# Altium schematic sheet HEATING.SchDoc
size A; SheetNumber: 3; SheetTotal: 12
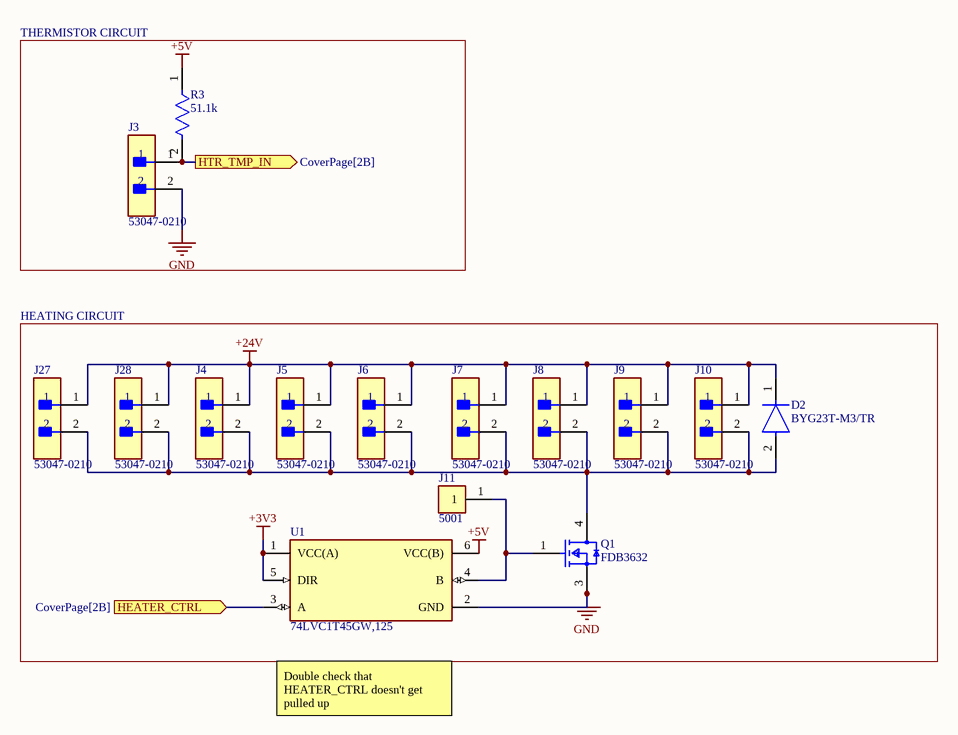
[diagram p0: HEATING.SchDoc]

## Parts
D2  BYG23T-M3/TR  [FP-SMA-MFG]
J3  53047-0210  [FP-53047-0210-MFG]
J4  53047-0210  [FP-53047-0210-MFG]
J5  53047-0210  [FP-53047-0210-MFG]
J6  53047-0210  [FP-53047-0210-MFG]
J7  53047-0210  [FP-53047-0210-MFG]
J8  53047-0210  [FP-53047-0210-MFG]
J9  53047-0210  [FP-53047-0210-MFG]
J10  53047-0210  [FP-53047-0210-MFG]
J11  5001  [FP-5001-MFG]
J27  53047-0210  [FP-53047-0210-MFG]
J28  53047-0210  [FP-53047-0210-MFG]
Q1  FDB3632  [FP-418AJ-MFG]
R3  51.1k  [FP-RG2012-MFG]
U1  74LVC1T45GW,125  [FP-SOT363-IPC_B]

## Blocks framed on the sheet
THERMISTOR CIRCUIT: J3 R3
HEATING CIRCUIT: D2 J4-J11 J27 J28 Q1 U1

## Ports
HEATER_CTRL (in, see CoverPage[2B]), HTR_TMP_IN (out, see CoverPage[2B])

## Nets
+3V3: U1.1(VCC(A)) U1.5(DIR)
+5V: R3.1 U1.6(VCC(B))
+24V: D2.1(C) J4.1 J5.1 J6.1 J7.1 J8.1 J9.1 J10.1 J27.1 J28.1
GND: J3.2 Q1.3(S) U1.2(GND)
HEATER_CTRL: U1.3(A) ; port HEATER_CTRL
HTR_TMP_IN: J3.1 R3.2 ; port HTR_TMP_IN
NetD2_2: D2.2(A) J4.2 J5.2 J6.2 J7.2 J8.2 J9.2 J10.2 J27.2 J28.2 Q1.4(D)
NetJ11_1: J11.1 Q1.1(G) U1.4(B)

## Notes on the sheet
- Double check that HEATER_CTRL doesn't get pulled up

## Library data of the parts
D2 = CMP-02540-000071-1: DIODE AVALANCHE 1300V 1A DO214AC; Element Configuration: Single; Reverse Voltage: 1.3kV; Zener Voltage: 200V; Reverse Recovery Time: 75ns; Max Forward Surge Current (Ifsm): 18A; Max Reverse Current: 5uA; Max Power Dissipation: 800mW; Forward Voltage: 1.74V; Min Operating Temperature: -55°C; Diode Type: Avalanche; Mount: Surface Mount; Series: BYG23T-M3; Radiation Hardening: No; Height: 2.29mm; Width: 2.79mm; Number of Pins: 2; Length: 4.5mm; Weight: 0.00388oz; Forward Current: 1A; Package Quantity: 1800; Recovery Time: 75ns; Peak Non-Repetitive Surge Current: 18A; Max Repetitive Reverse Voltage (Vrrm): 1.3kV; Average Rectified Current: 1A; Contact Plating: Tin; RoHS Compliant: Yes; Case/Package: SMA; Max Reverse Voltage (DC): 1.3kV; Max Operating Temperature: 150°C; Packaging: Cut Tape; Max Surge Current: 18A
J3-J10 J27 J28 = CMP-2000-05628-3: CONN HEADER VERT 2POS 1.25MM; Manufacturer: Molex; Conn Gender: Male; Voltage Rating: 125V; Conn Orientation: Vertical; Number Of Contacts: 2; Current Rating: 1A; Contact Material: Tin; Temperature Range Low: -40°C; ComponentLink2URL: http://www.molex.com/webdocs/datasheets/pdf/en-us/0530470210_PCB_HEADERS.pdf; Mouser Description: 1.25mm Pitch PicoBlade™ Wire-to-Board Header, Vertical, with Friction Lock, 2 Circuits; Manufacturer Part Number: 53047-0210; Temperature Range High: +85°C; ComponentLink2Description: Datasheet; Automotive: No; RoHS: TRUE; Ambient Temperature Range High: +85°C; Octopart: https://octopart.com/53047-0210-molex-276772; Footprint Url: https://www.molex.com/pdm_docs/sd/530470210_sd.pdf; Lead Free: Yes; Pitch: 1.25mm; Temperature: -40°C to +85°C; Device Class L2: Headers and Wire Housings; Package: 0; Ambient Temperature Range Low: -40°C; Digikey Description: CONN HEADER VERT 2POS 1.25MM; Category: Conn; Device Class L3: unset; Number Of Rows: 1; Device Class L1: Connectors; Height: 4.4mm
J11 = CMP-2000-05181-2: PC TEST POINT MINIATURE BLACK; Body Material: Bronze; Plating: Silver; Inside Diameter: 1.27mm; Hole Diameter: 1.6mm; Number of Ports: 1; Outside Diameter: 2.54mm; Insulation: Insulated; Insulation Material: Nylon; Mount: Through Hole; RoHS Compliant: Yes; Series: THM; Height: 0.3inch; Termination: Through Hole; Material: Nylon; Packaging: Bulk; Contact Material: Bronze; REACH SVHC: No SVHC; Contact Plating: Silver; Orientation: Straight; Lead Free: Lead Free; Package Quantity: 100; Length: 7.62mm; Flammability Rating: UL94 V-0; Number of Contacts: 1; Diameter: 2.54mm; Housing Color: Black; Color: Black
Q1 = CMP-07173-000068-1: MOSFET N-CH 100V 80A D2PAK; Manufacturer: ON Semiconductor; Threshold Vgs Min: 2V; Turn On Delay Time: 30ns; Reverse Recovery Charge: 120nC; Input Capacitace At Vds: 6000pF @ 25V; Max Junction Temp: +175°C; Threshold Vgs Max: 4V; Number Of Channels: 1; Drain To Source Resistance: 0.0075Ω; Power Dissipation: 310W; Reverse Recovery Time: 64ns; Rthja Max: 43°C/W; Continuous Drain Current: 12A; Depletion Mode: False; Standoff Height: 0mm; Gate To Source Voltage: 20V; Turn Off Delay Time: 96ns; Gate Charge At Vgs: 84nC @ 10V; Max Forward Diode Voltage: 1.25V; Footprint Url: https://www.onsemi.com/pub/Collateral/418AJ.PDF; Category: Trans; ComponentLink2URL: https://www.onsemi.com/pub/Collateral/FDP3632-D.PDF; Package: 418AJ; Drain To Source Voltage: 100V; ComponentLink2Description: Datasheet; Temperature Range Low: -55°C; Device Class L2: Transistors; Digikey Description: MOSFET N-CH 100V 80A D2PAK; Device Class L3: MOSFETs; Automotive: No; Drain To Source Breakdown Voltage: 100V; Octopart: https://octopart.com/fdb3632-on+semiconductor-84325670; Number Of N Channels: 1; Temperature Range High: +175°C; Device Class L1: Discrete Semiconductors; RoHS: TRUE; Lead Free: Yes; Height: 5.08mm; Manufacturer Part Number: FDB3632; Mouser Description: MOSFET N-Channel PowerTrench; Temperature: -55°C to +175°C
R3 = CMP-2001-03008-2: Automotive Metal Thin Film Chip Resistor, 0805, 51.1kΩ, 0.1%, 25ppm/°C, 0.125W, 150V; Power Rating: 125mW; Resistance: 51.1kR; Number of Terminations: 2; Case Code (Imperial): 0805; Height: 0.02inch; Min Operating Temperature: -55°C; Voltage Rating: 150V; Length: 0.079inch; Lead Free: Lead Free; Resistor Type: Thin Film; Tolerance: 0.1%; Weight: 0.000194oz; Termination: SMD/SMT; Max Power Dissipation: 125mW; Packaging: Tape and Reel; Width: 1.2mm; Series: RG; Max Operating Temperature: 155°C; Case/Package: 0805; Temperature Coefficient: 25ppm/°C; Package Quantity: 1; Case Code (Metric): 2012; RoHS Compliant: Yes; Voltage Rating (DC): 150V; Features: Automotive AEC-Q200
U1 = CMP-14347-000008-1: IC TRNSLTR BIDIRECTIONAL 6TSSOP